# Altium schematic sheet MCU1.SchDoc
size A4
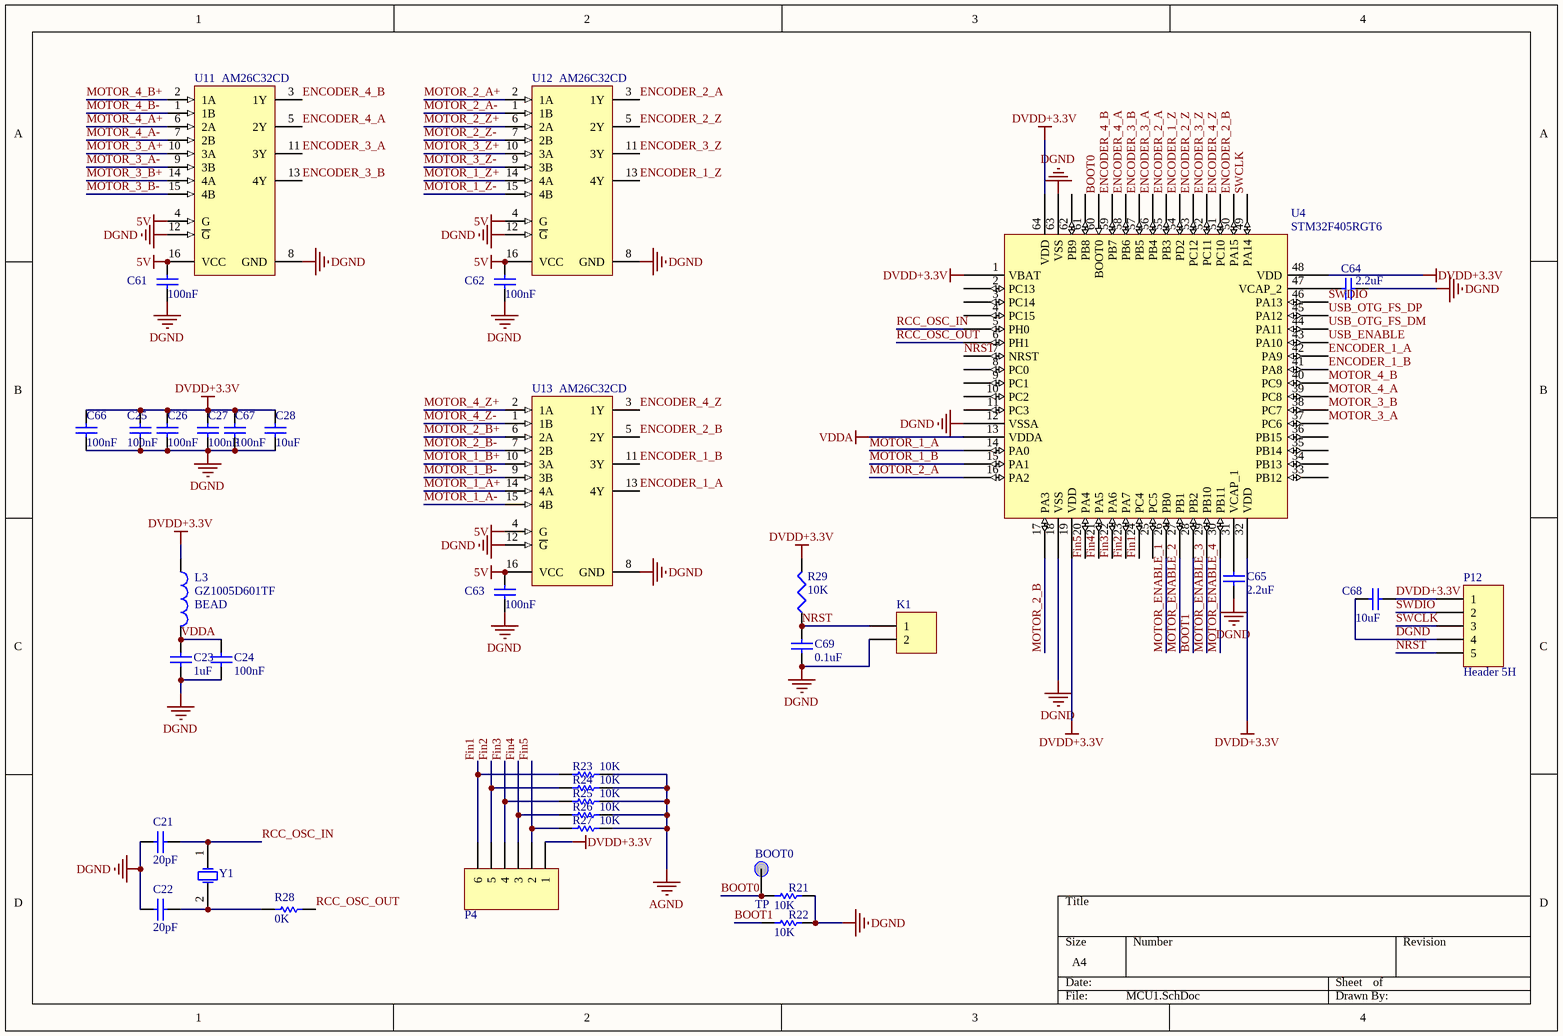
[diagram p0: MCU1.SchDoc]

## Parts
BOOT0  TP  [TestPort]
C21  20pF  [0402]
C22  20pF  [0402]
C23  1uF  [1608[0603]]
C24  100nF  [1608[0603]]
C25  100nF  [1608[0603]]
C26  100nF  [1608[0603]]
C27  100nF  [1608[0603]]
C28  10uF  [1608[0603]]
C61  100nF  [1608[0603]]
C62  100nF  [1608[0603]]
C63  100nF  [1608[0603]]
C64  2.2uF  [1608[0603]]
C65  2.2uF  [1608[0603]]
C66  100nF  [1608[0603]]
C67  100nF  [1608[0603]]
C68  10uF  [1608[0603]]
C69  0.1uF  [1608[0603]]
K1  Header 2  [Button]  (value not drawn)
L3  GZ1005D601TF  [0402-A]
P4  Header 6  [HDR1X6]  (value not drawn)
P12  Header 5H  [HDR1X5H]
R21  10K  [J1-0603]
R22  10K  [J1-0603]
R23  10K  [RES[0402]]
R24  10K  [RES[0402]]
R25  10K  [RES[0402]]
R26  10K  [RES[0402]]
R27  10K  [RES[0402]]
R28  0K  [J1-0603]
R29  10K  [J1-0603]
U4  STM32F405RGT6  [STM32F405RGT6]
U11  AM26C32CD  [D16_L]
U12  AM26C32CD  [D16_L]
U13  AM26C32CD  [D16_L]
Y1  XTAL  [Crystal_HCM49]  (value not drawn)

## Nets
5V: C61.2 C62.2 C63.2 U11.4(G) U11.16(VCC) U12.4(G) U12.16(VCC) U13.4(G) U13.16(VCC)
AGND: R23.2 R24.2 R25.2 R26.2 R27.2
DGND: C21.1 C22.1 C23.1 C24.1 C25.1 C26.1 C27.1 C28.1 C61.1 C62.1 C63.1 C64.2 C65.1 C66.1 C67.1 C68.1 C69.1 K1.2 P12.4 R21.2 R22.2 U4.12(VSSA) U4.18(VSS) U4.63(VSS) U11.8(GND) U11.12(~{G}) U12.8(GND) U12.12(~{G}) U13.8(GND) U13.12(~{G})
DVDD+3.3V: C25.2 C26.2 C27.2 C28.2 C66.2 C67.2 C68.2 L3.1 P4.1 P12.1 R29.2 U4.1(VBAT) U4.19(VDD) U4.32(VDD) U4.48(VDD) U4.64(VDD)
VDDA: C23.2 C24.2 L3.2 U4.13(VDDA)
BOOT0: BOOT0.0 R21.1 U4.60(BOOT0)
BOOT1: R22.1 U4.28(PB2)
ENCODER_1_A: U4.42(PA9) U13.13(4Y)
ENCODER_1_B: U4.41(PA8) U13.11(3Y)
ENCODER_1_Z: U4.54(PD2) U12.13(4Y)
ENCODER_2_A: U4.55(PB3) U12.3(1Y)
ENCODER_2_B: U4.50(PA15) U13.5(2Y)
ENCODER_2_Z: U4.53(PC12) U12.5(2Y)
ENCODER_3_A: U4.56(PB4) U11.11(3Y)
ENCODER_3_B: U4.57(PB5) U11.13(4Y)
ENCODER_3_Z: U4.52(PC11) U12.11(3Y)
ENCODER_4_A: U4.58(PB6) U11.5(2Y)
ENCODER_4_B: U4.59(PB7) U11.3(1Y)
ENCODER_4_Z: U4.51(PC10) U13.3(1Y)
Fin1: P4.6 R23.1 U4.24(PC4)
Fin2: P4.5 R24.1 U4.23(PA7)
Fin3: P4.4 R25.1 U4.22(PA6)
Fin4: P4.3 R26.1 U4.21(PA5)
Fin5: P4.2 R27.1 U4.20(PA4)
MOTOR_1_A: U4.14(PA0)
MOTOR_1_A+: U13.14(4A)
MOTOR_1_A-: U13.15(4B)
MOTOR_1_B: U4.15(PA1)
MOTOR_1_B+: U13.10(3A)
MOTOR_1_B-: U13.9(3B)
MOTOR_1_Z+: U12.14(4A)
MOTOR_1_Z-: U12.15(4B)
MOTOR_2_A: U4.16(PA2)
MOTOR_2_A+: U12.2(1A)
MOTOR_2_A-: U12.1(1B)
MOTOR_2_B: U4.17(PA3)
MOTOR_2_B+: U13.6(2A)
MOTOR_2_B-: U13.7(2B)
MOTOR_2_Z+: U12.6(2A)
MOTOR_2_Z-: U12.7(2B)
MOTOR_3_A: U4.37(PC6)
MOTOR_3_A+: U11.10(3A)
MOTOR_3_A-: U11.9(3B)
MOTOR_3_B: U4.38(PC7)
MOTOR_3_B+: U11.14(4A)
MOTOR_3_B-: U11.15(4B)
MOTOR_3_Z+: U12.10(3A)
MOTOR_3_Z-: U12.9(3B)
MOTOR_4_A: U4.39(PC8)
MOTOR_4_A+: U11.6(2A)
MOTOR_4_A-: U11.7(2B)
MOTOR_4_B: U4.40(PC9)
MOTOR_4_B+: U11.2(1A)
MOTOR_4_B-: U11.1(1B)
MOTOR_4_Z+: U13.2(1A)
MOTOR_4_Z-: U13.1(1B)
MOTOR_ENABLE_1: U4.26(PB0)
MOTOR_ENABLE_2: U4.27(PB1)
MOTOR_ENABLE_3: U4.29(PB10)
MOTOR_ENABLE_4: U4.30(PB11)
NRST: C69.2 K1.1 P12.5 R29.1 U4.7(NRST)
RCC_OSC_IN: C21.2 U4.5(PH0) Y1.1(OSC1)
RCC_OSC_OUT: R28.2 U4.6(PH1)
SWCLK: P12.3 U4.49(PA14)
SWDIO: P12.2 U4.46(PA13)
USB_ENABLE: U4.43(PA10)
USB_OTG_FS_DM: U4.44(PA11)
USB_OTG_FS_DP: U4.45(PA12)
NetC22_2: C22.2 R28.1 Y1.2(OSC2)
NetC64_1: C64.1 U4.47(VCAP_2)
NetC65_2: C65.2 U4.31(VCAP_1)

Not connected (* = marked no-connect by the designer): U4 2(PC13) 3(PC14) 4(PC15) 8(PC0) 9(PC1) 10(PC2) 11(PC3) 25(PC5) 33(PB12) 34(PB13) 35(PB14) 36(PB15) 61(PB8) 62(PB9)

## Notes on the sheet
- (near L3) BEAD

## Library data of the parts
BOOT0 = TestPoint
C21-C28 C61-C69 = Cap: Capacitor; Published: 8-Jun-2000; LatestRevisionDate: 17-Jul-2002; LatestRevisionNote: Re-released for DXP Platform.; PackageReference: RAD-0.3; Publisher: Altium Limited; PackageDescription: Radial Cap, Thru-Hole; 2 Leads; 0.3 in Pin Spacing
  C21 C22: Value: 20pF
  C23: Value: 1uF
  C24-C27 C61-C63 C66 C67: Value: 100nF
  C28 C68: Value: 10uF
  C64 C65: Value: 2.2uF
  C69: Value: 0.1uF
K1 = Header 2: Header, 2-Pin; LatestRevisionDate: 17-Jul-2002; LatestRevisionNote: Re-released for DXP Platform.; Publisher: Altium Limited
L3 = Inductor: Code_IEC: 1005; Published: 8-Jun-2000; LatestRevisionDate: 29-May-2009; LatestRevisionNote: IPC-7351 Footprint Added.; PackageReference: 0402-A; Publisher: Altium Limited; PackageDescription: Chip Inductor; Code_JEITA: 0402
P4 = Header 6: Header, 6-Pin; LatestRevisionDate: 17-Jul-2002; LatestRevisionNote: Re-released for DXP Platform.; Publisher: Altium Limited
P12 = Header 5H: Header, 5-Pin, Right Angle; LatestRevisionDate: 17-Jul-2002; LatestRevisionNote: Re-released for DXP Platform.; Publisher: Altium Limited
R21-R28 = Res1: Resistor; Published: 8-Jun-2000; LatestRevisionDate: 17-Jul-2002; LatestRevisionNote: Re-released for DXP Platform.; PackageReference: AXIAL-0.3; Publisher: Altium Limited; PackageDescription: Axial Device, Thru-Hole; 2 Leads; 0.3 in Pin Spacing
  R21-R27: Value: 10K
  R28: Value: 0K
R29 = Res3: Resistor; Published: 8-Jun-2000; LatestRevisionDate: 29-May-2009; LatestRevisionNote: IPC-7351 Footprint Added.; PackageReference: J1-0603; Publisher: Altium Limited; PackageDescription: Chip Resistor; Value: 10K
U4 = STM32F405RGT6: IC MCU 32BIT 1MB FLASH 64LQFP
U11-U13 = AM26C32CD: Quadruple Differential Line Receiver, 0 TX / 4 RX, 5V, 0 to 70 degC, 16-Pin SOIC(D), Green (RoHS & no Sb/Br); Manufacturer: Texas Instruments; SubFamily: RS-422; Receivers Per Package: 4; ICC(Max)(mA): 15; Supply Voltage(s)(V): 5; ESD(kV): 2; Rating: Catalog; DatasheetVersion: SLLS104I; PackageVersion: revM, Jun-2011; PackageReference: D16; PackageDescription: 16-Pin Plastic Small Outline Integrated Circuit, 9.9 x 3.9 mm, Pitch 1.27 mm Pitch; PartNumber: AM26C32CD; Mounting Technology: Surface Mount; Eco-Plan: Green (RoHS & no Sb/Br); # of TX/RX: 0 TX / 4 RX; Footprint: AM26LS32; Code_JEDEC: MS-012AC; ComponentLink1Description: Datasheet; ComponentLink1URL: http://www.ti.com/general/docs/lit/getliterature.tsp?genericPartNumber=AM26C32&fileType=pdf; ComponentLink2Description: Package Specification; ComponentLink2URL: http://www.ti.com/litv/pdf/mpds178g
Y1 = XTAL: Crystal Oscillator; Published: 8-Jun-2000; LatestRevisionDate: 17-Jul-2002; LatestRevisionNote: Re-released for DXP Platform.; PackageReference: R38; Publisher: Altium Limited; PackageDescription: Crystal, Thru-Hole; 2 Leads; Body 3.1 x 8.2 mm (Dia.xH)